# EAGLE design eCog103_Sensor (EAGLE 6.6.0)
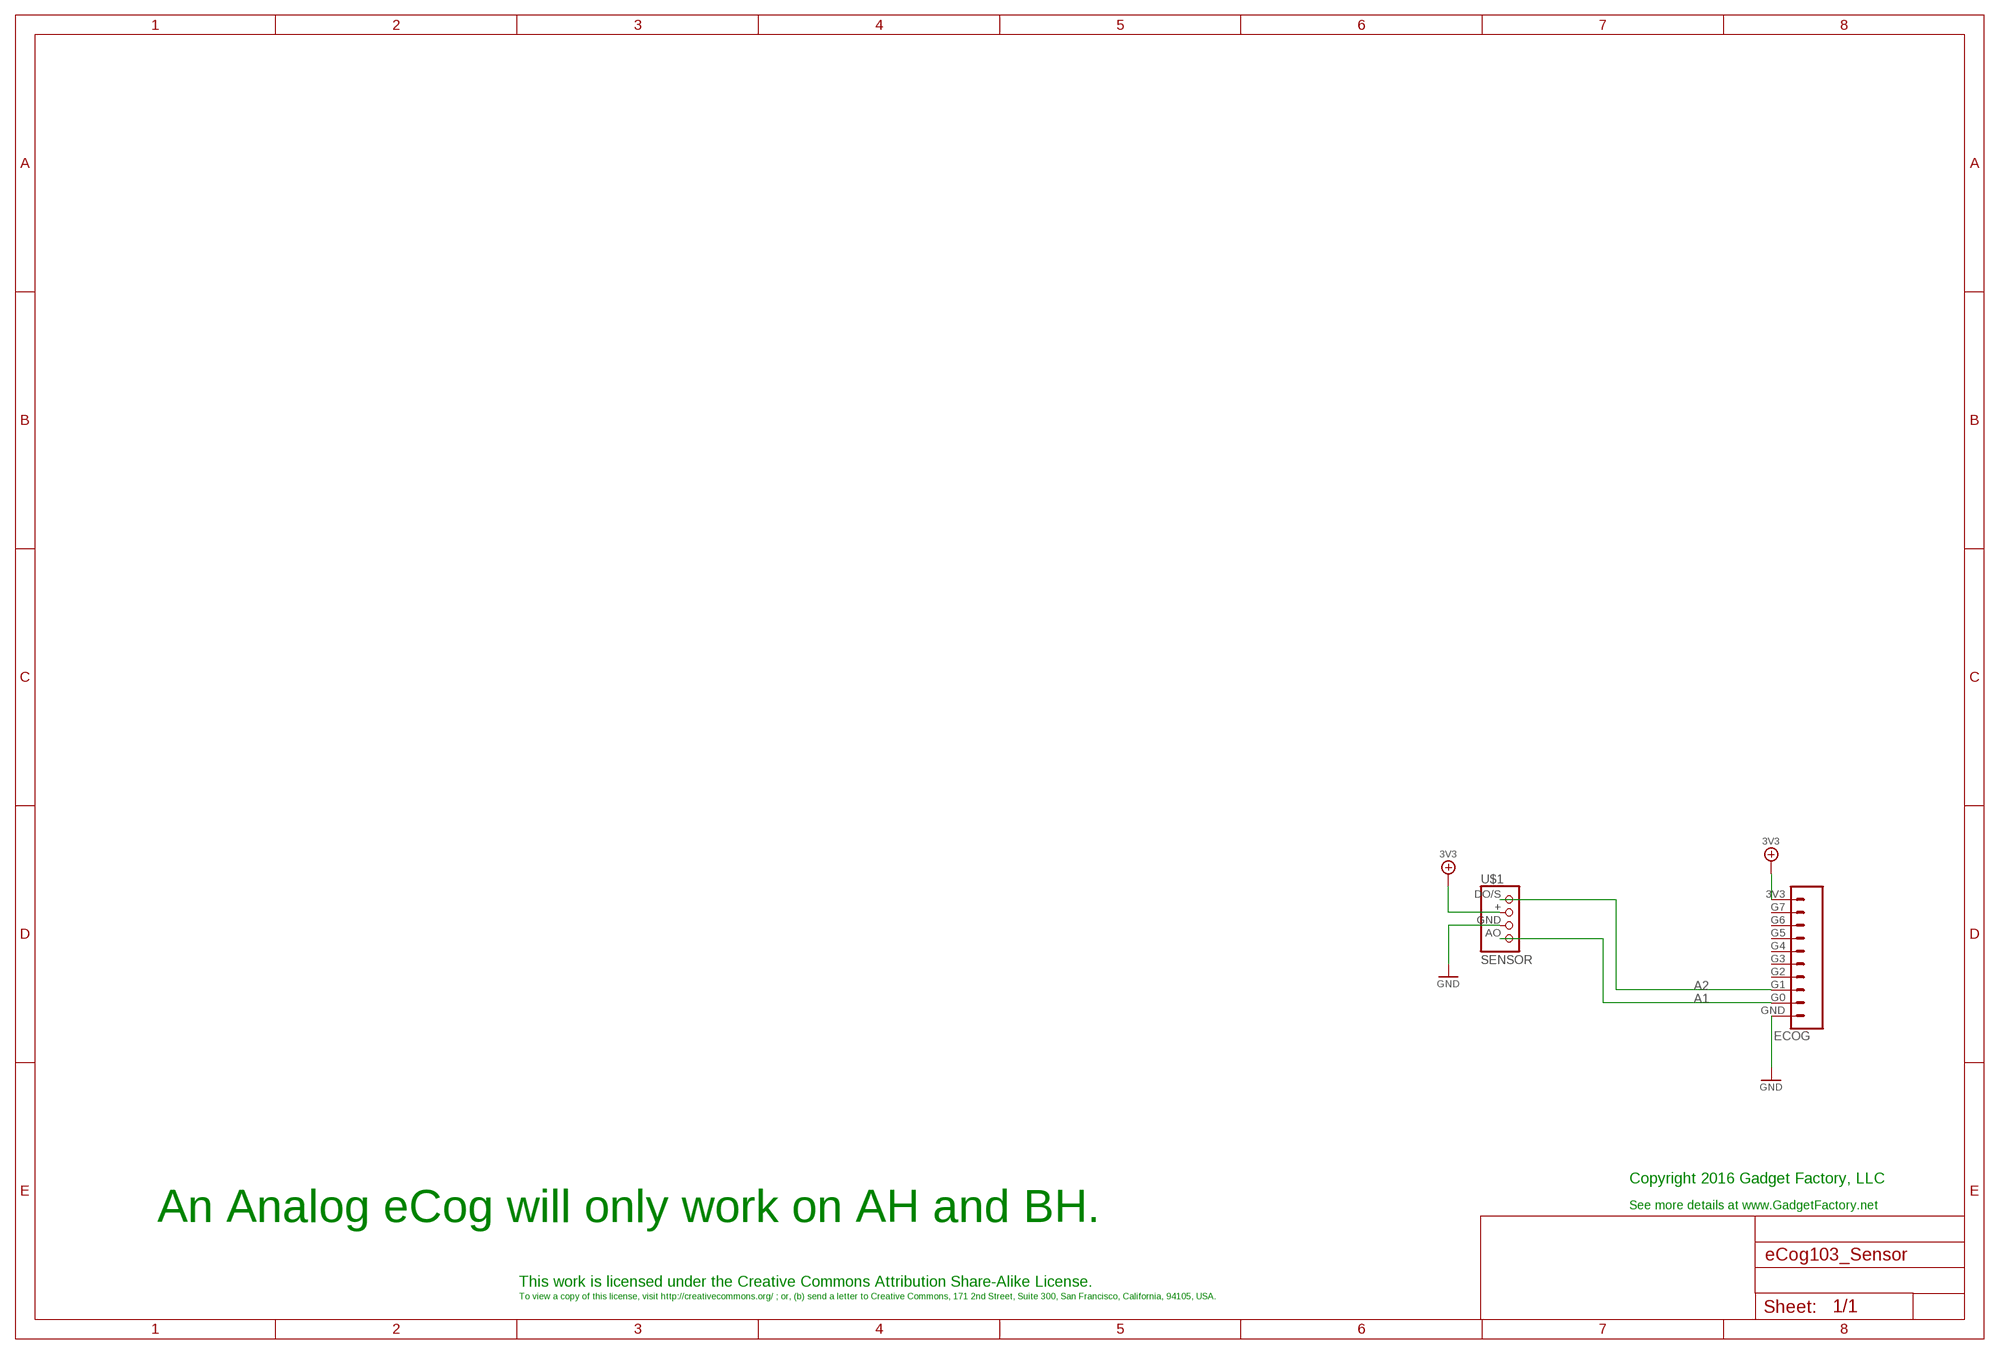
[diagram p0: schematic, sheet 1]

## Parts
ECOG  ECOG_GENERAL_ROWECOG_GENERAL_SMD  [ECOG_GENERAL_SMD]
U$1  SENSOR  [SENSOR-HJX4]

## Nets
3V3: ECOG.3V3 U$1.+
A1: ECOG.G0 U$1.AO
A2: ECOG.G1 U$1.DO/S
GND: ECOG.GND U$1.GND
Unconnected: ECOG.G2 ECOG.G3 ECOG.G4 ECOG.G5 ECOG.G6 ECOG.G7

## Notes on the sheet
- Copyright 2016 Gadget Factory, LLC
- See more details at www.GadgetFactory.net
- An Analog eCog will only work on AH and BH.
- This work is licensed under the Creative Commons Attribution Share-Alike License.
- To view a copy of this license, visit http://creativecommons.org/ ; or, (b) send a letter to Creative Commons, 171 2nd Street, Suite 300, San Francisco, California, 94105, USA.

## Library data of the parts
ECOG = eCogs:ECOG_GENERAL_ROW; DIGIKEY: S1013EC-10-ND
U$1 = eCogs:SENSOR

## Board
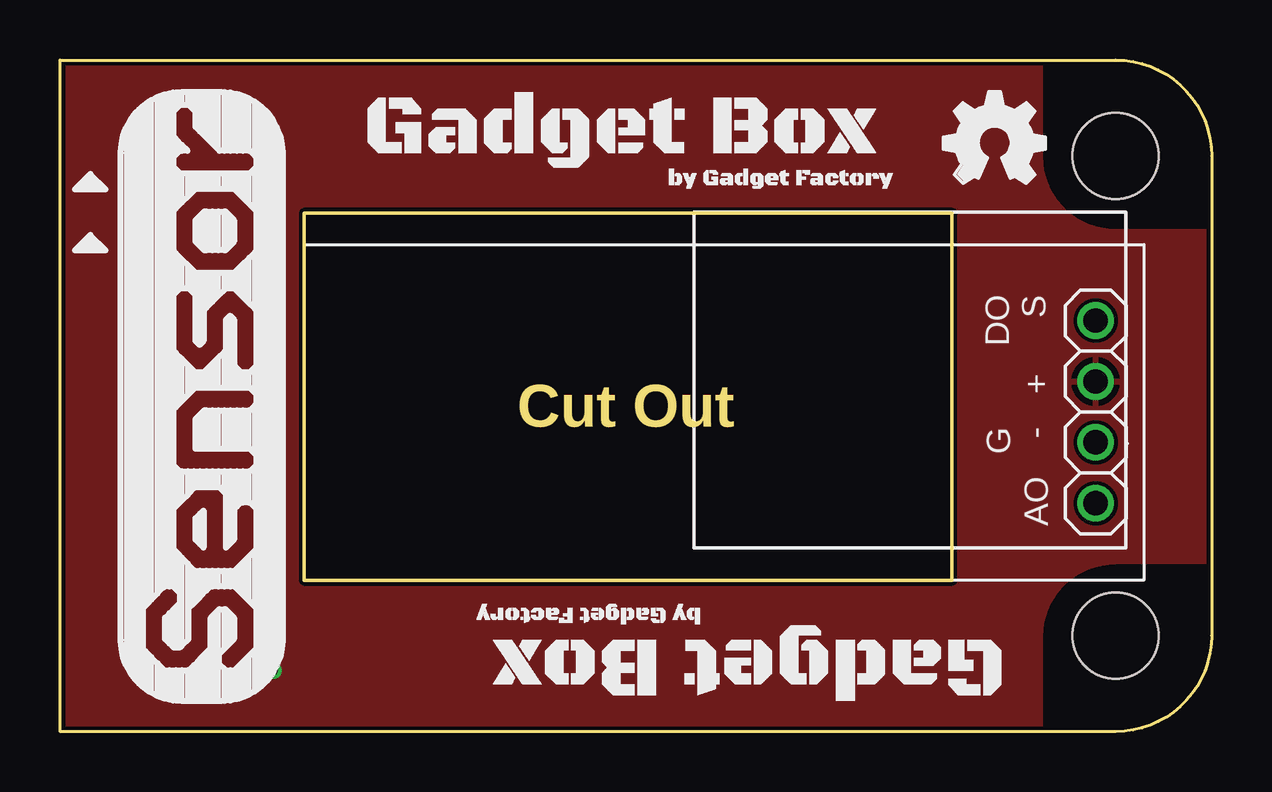
[diagram p1: board, top side]
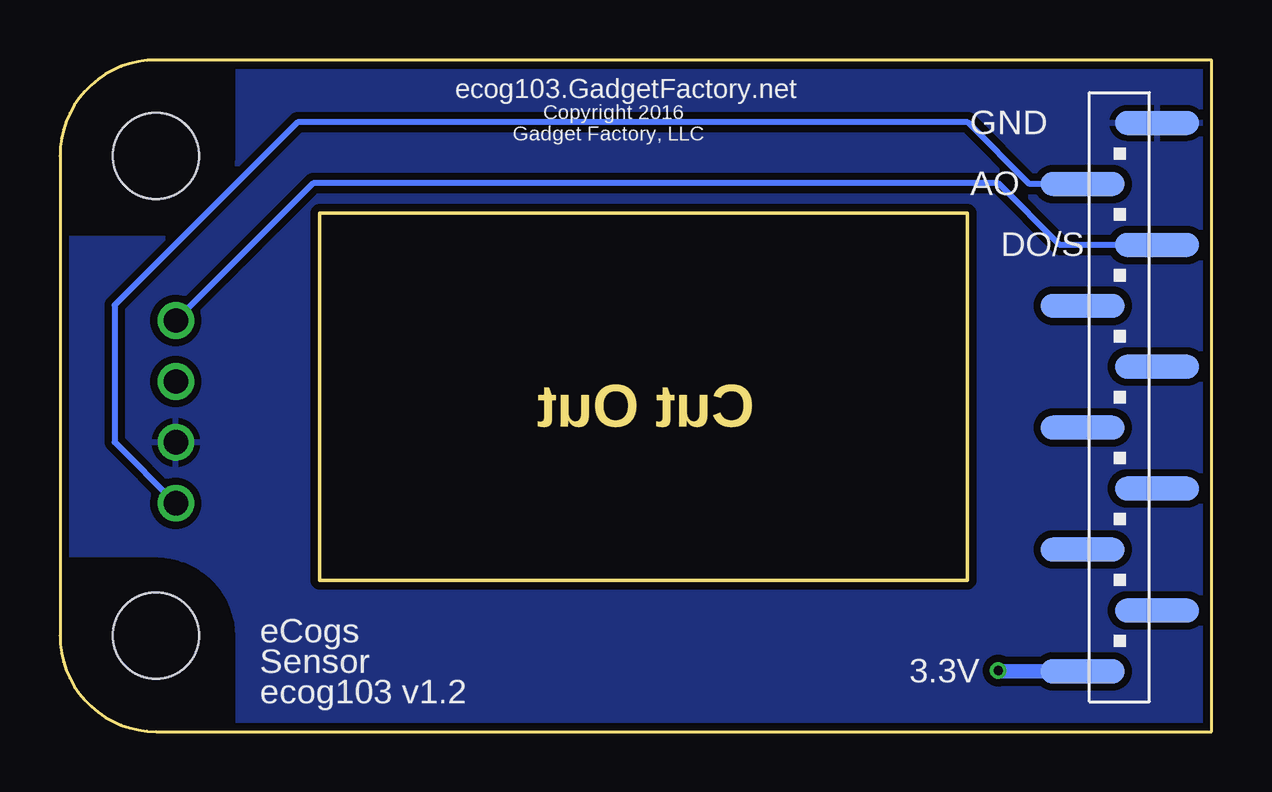
[diagram p2: board, bottom side, seen from below]

Size 48 x 28 mm. Coordinates in mm from the lower left corner, seen from the top.
Copper layers (1*16): Top 0.035mm / dielectric 1.5mm / Bottom 0.035mm
Design rules "hackvana *": minimum track width 6mil, minimum drill 0.3mm, track to track 6mil, track to pad 6mil, pad to pad 6mil, via to via 6mil, smd to smd 0mil, copper to edge 6mil, drill to drill 6mil, minimum pad ring 10mil, minimum via ring 6mil, stop-mask expansion 2mil, vias tented up to drill 100mil, thermal gap 10mil

### Footprints (pad centres in the part's own frame; a part is rotated, then mirrored left to right if it is on the bottom)
ECOG_GENERAL_SMD = smd 3.5 x 1 bottom: 3V3 5.369,2.51; G0 5.369,22.83; G1 2.271,20.29; G2 5.369,17.75; G3 2.271,15.21; G4 5.369,12.67; G5 2.271,10.13; G6 5.369,7.59; G7 2.271,5.05; GND 2.271,25.37 | hole 3.6: 44,4; 44,24
SENSOR-HJX4 = drill 1.016: + -1.29,-2.01; AO 3.79,-2.01; DO/S -3.83,-2.01; GND 1.25,-2.01

### Placement (x,y rotation side)
ECOG  0,0 0 top
U$1  45.18,13.3 270 top
U$2  [LEGEND_ANALOG]  1.27,22.86 0 top
U$3  [LEGEND_ANALOG]  1.27,20.32 0 top
U$4  [GADGETBOX_SMALL]  23.5,25.02 0 top
U$5  [OSHW_FILLX150_NOTEXT]  36.83,22.86 0 top
U$6  [GADGETBOX_SMALL]  28.57,2.92 180 top

### Tracks (layer width: path | path; a pad name or v marks a point on that pad's centre or on a via)
3V3  (via drill 0.38)
  Top 0.61: v8.89,2.54 8.89,3.81
  Bottom 0.61: ECOG.3V3 8.86,2.51 v8.89,2.54
  pour Top: -1.27,29.27 49.27,29.27 49.27,-1.27 -1.27,-1.27
A1
  Bottom 0.254: ECOG.G0 7.59,22.83 10.16,25.4 38.1,25.4 45.72,17.78 45.72,12.06 U$1.AO
A2
  Bottom 0.254: ECOG.G1 6.32,20.29 8.89,22.86 37.45,22.86 U$1.DO/S
GND
  pour Bottom (isolate 0.305): -2.54,30.54 50.54,30.54 50.54,-2.54 -2.54,-2.54

### Text on the board
Dimension: Cut Out
bPlace: Copyright 2016 | ecog103.GadgetFactory.net | GND | Gadget Factory, LLC | AO | DO/S | eCogs | 3.3V | Sensor | ecog103 v1.2